# Altium schematic sheet Input.SchDoc
size A4
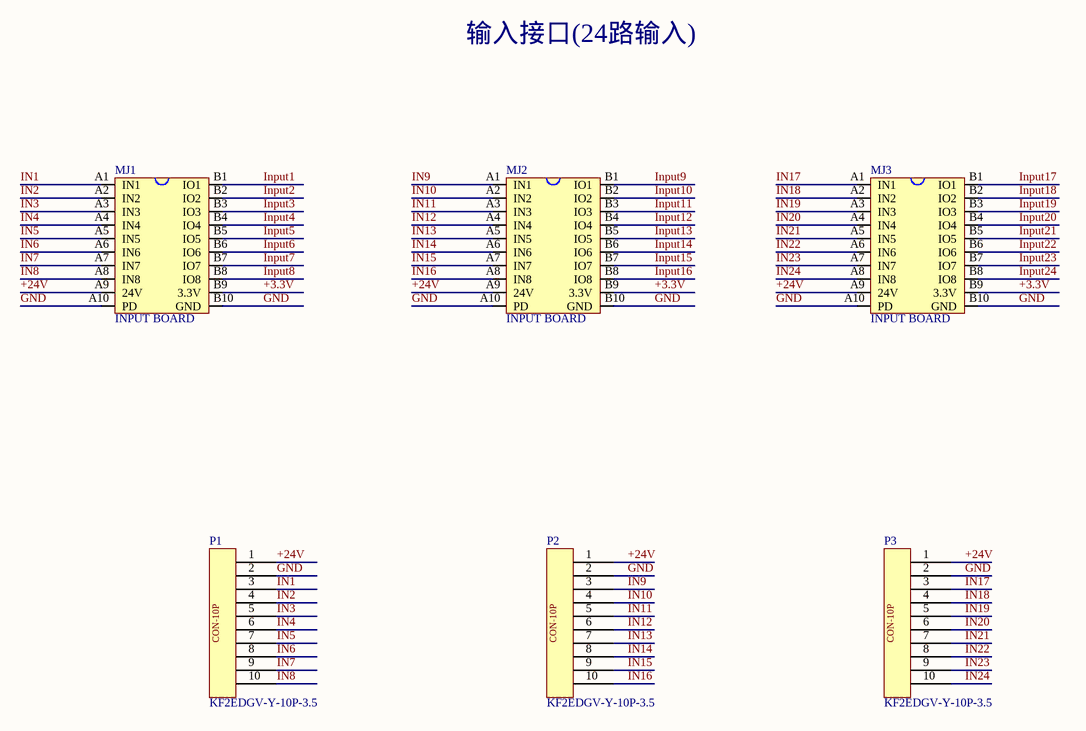
[diagram p0: Input.SchDoc]

## Parts
MJ1  INPUT BOARD  [INPUT BOARD]
MJ2  INPUT BOARD  [INPUT BOARD]
MJ3  INPUT BOARD  [INPUT BOARD]
P1  KF2EDGV-Y-10P-3.5  [KF2EDGV-Y-10P-3.5]
P2  KF2EDGV-Y-10P-3.5  [KF2EDGV-Y-10P-3.5]
P3  KF2EDGV-Y-10P-3.5  [KF2EDGV-Y-10P-3.5]

## Nets
+3.3V: MJ1.B9(3.3V) MJ2.B9(3.3V) MJ3.B9(3.3V)
+24V: MJ1.A9(24V) MJ2.A9(24V) MJ3.A9(24V) P1.1 P2.1 P3.1
GND: MJ1.A10(PD) MJ1.B10(GND) MJ2.A10(PD) MJ2.B10(GND) MJ3.A10(PD) MJ3.B10(GND) P1.2 P2.2 P3.2
IN1: MJ1.A1(IN1) P1.3
IN2: MJ1.A2(IN2) P1.4
IN3: MJ1.A3(IN3) P1.5
IN4: MJ1.A4(IN4) P1.6
IN5: MJ1.A5(IN5) P1.7
IN6: MJ1.A6(IN6) P1.8
IN7: MJ1.A7(IN7) P1.9
IN8: MJ1.A8(IN8) P1.10
IN9: MJ2.A1(IN1) P2.3
IN10: MJ2.A2(IN2) P2.4
IN11: MJ2.A3(IN3) P2.5
IN12: MJ2.A4(IN4) P2.6
IN13: MJ2.A5(IN5) P2.7
IN14: MJ2.A6(IN6) P2.8
IN15: MJ2.A7(IN7) P2.9
IN16: MJ2.A8(IN8) P2.10
IN17: MJ3.A1(IN1) P3.3
IN18: MJ3.A2(IN2) P3.4
IN19: MJ3.A3(IN3) P3.5
IN20: MJ3.A4(IN4) P3.6
IN21: MJ3.A5(IN5) P3.7
IN22: MJ3.A6(IN6) P3.8
IN23: MJ3.A7(IN7) P3.9
IN24: MJ3.A8(IN8) P3.10
Input1: MJ1.B1(IO1)
Input2: MJ1.B2(IO2)
Input3: MJ1.B3(IO3)
Input4: MJ1.B4(IO4)
Input5: MJ1.B5(IO5)
Input6: MJ1.B6(IO6)
Input7: MJ1.B7(IO7)
Input8: MJ1.B8(IO8)
Input9: MJ2.B1(IO1)
Input10: MJ2.B2(IO2)
Input11: MJ2.B3(IO3)
Input12: MJ2.B4(IO4)
Input13: MJ2.B5(IO5)
Input14: MJ2.B6(IO6)
Input15: MJ2.B7(IO7)
Input16: MJ2.B8(IO8)
Input17: MJ3.B1(IO1)
Input18: MJ3.B2(IO2)
Input19: MJ3.B3(IO3)
Input20: MJ3.B4(IO4)
Input21: MJ3.B5(IO5)
Input22: MJ3.B6(IO6)
Input23: MJ3.B7(IO7)
Input24: MJ3.B8(IO8)

## Notes on the sheet
- 输入接口(24路输入)

## Library data of the parts
MJ1-MJ3 = J-INPUT
P1-P3 = CON-10P